# EAGLE design WalkerStalkerv03 (EAGLE 6.4)
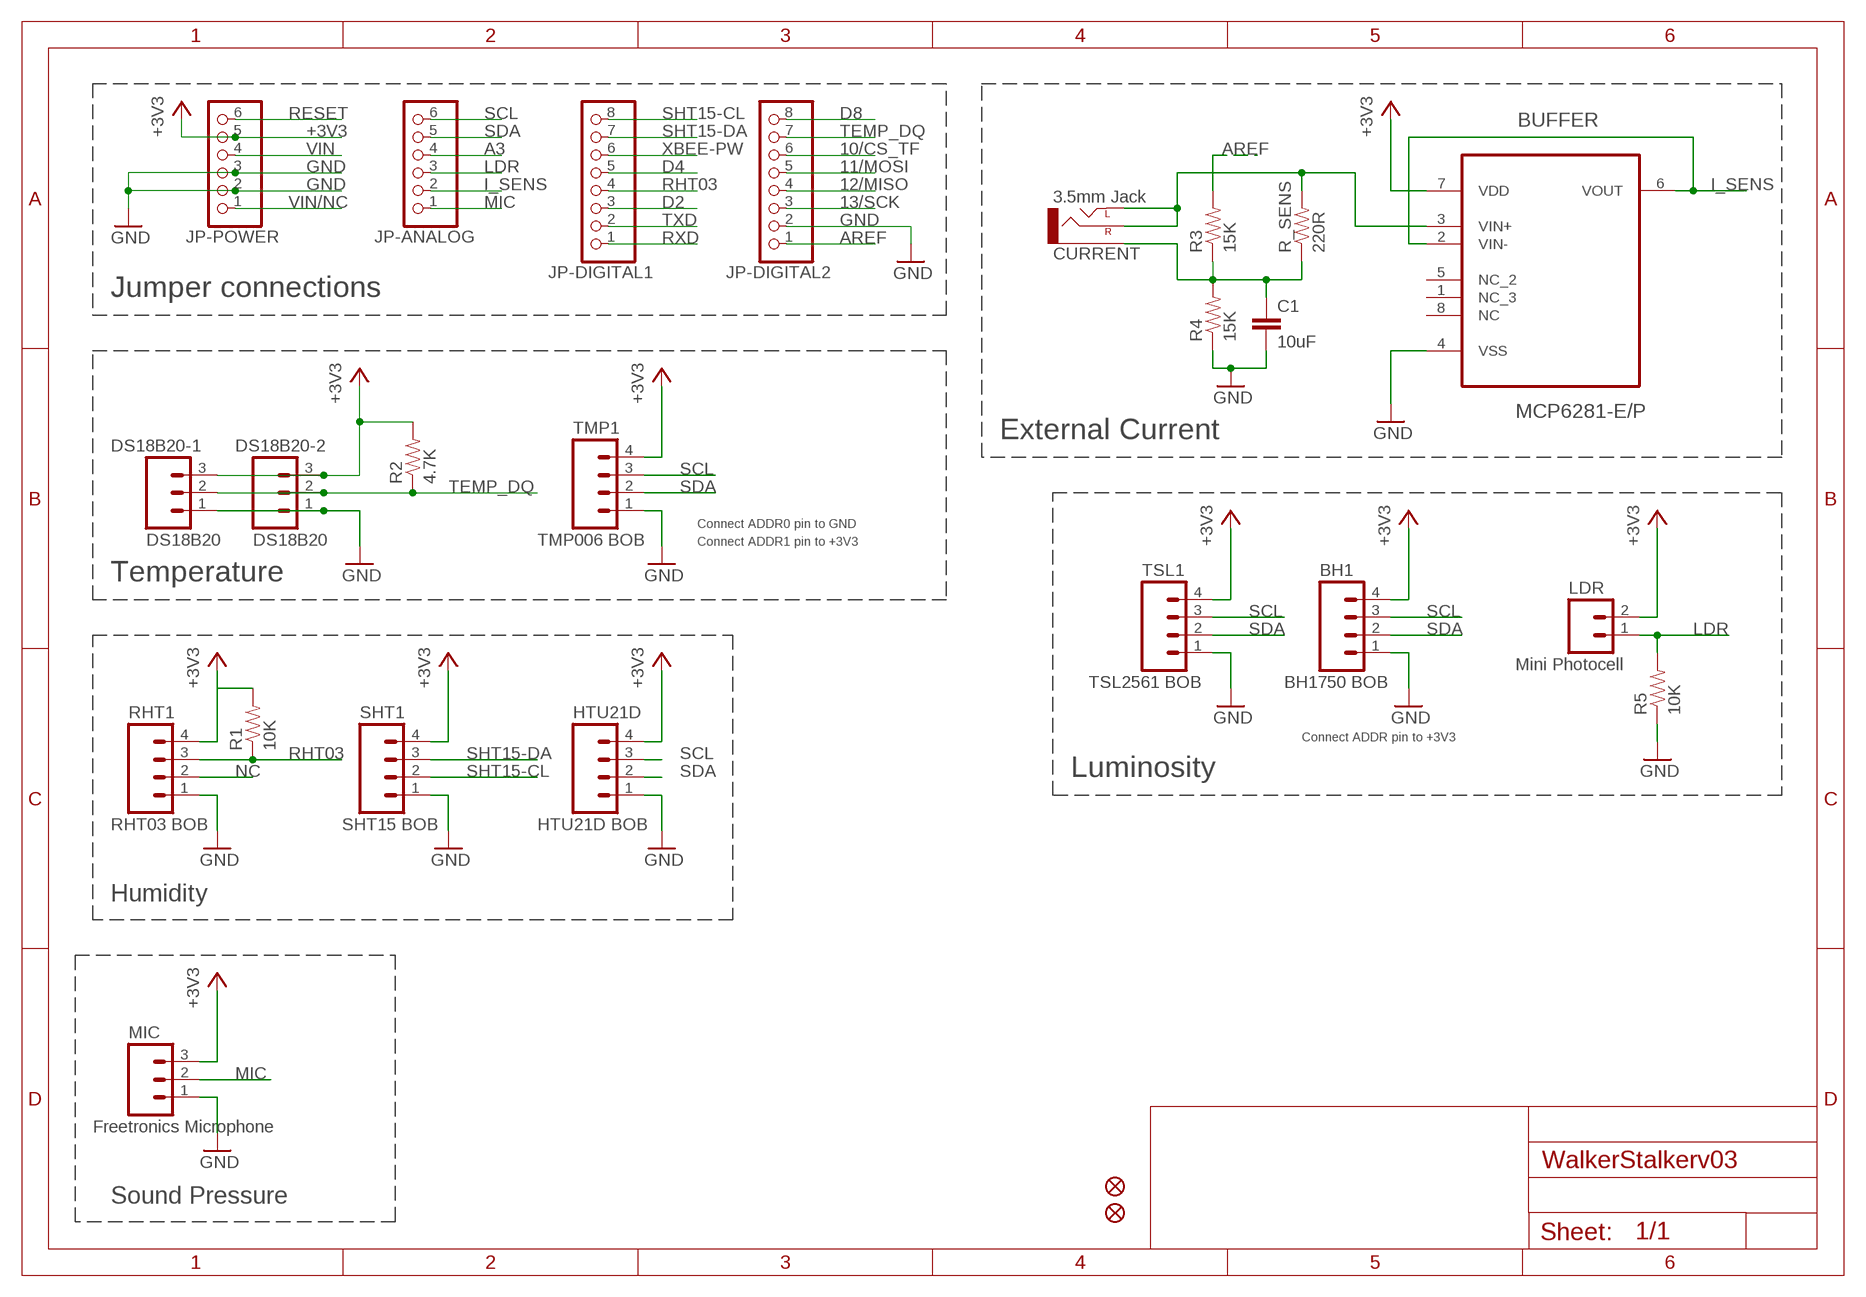
[diagram p0: schematic, sheet 1, part 1 of 2]
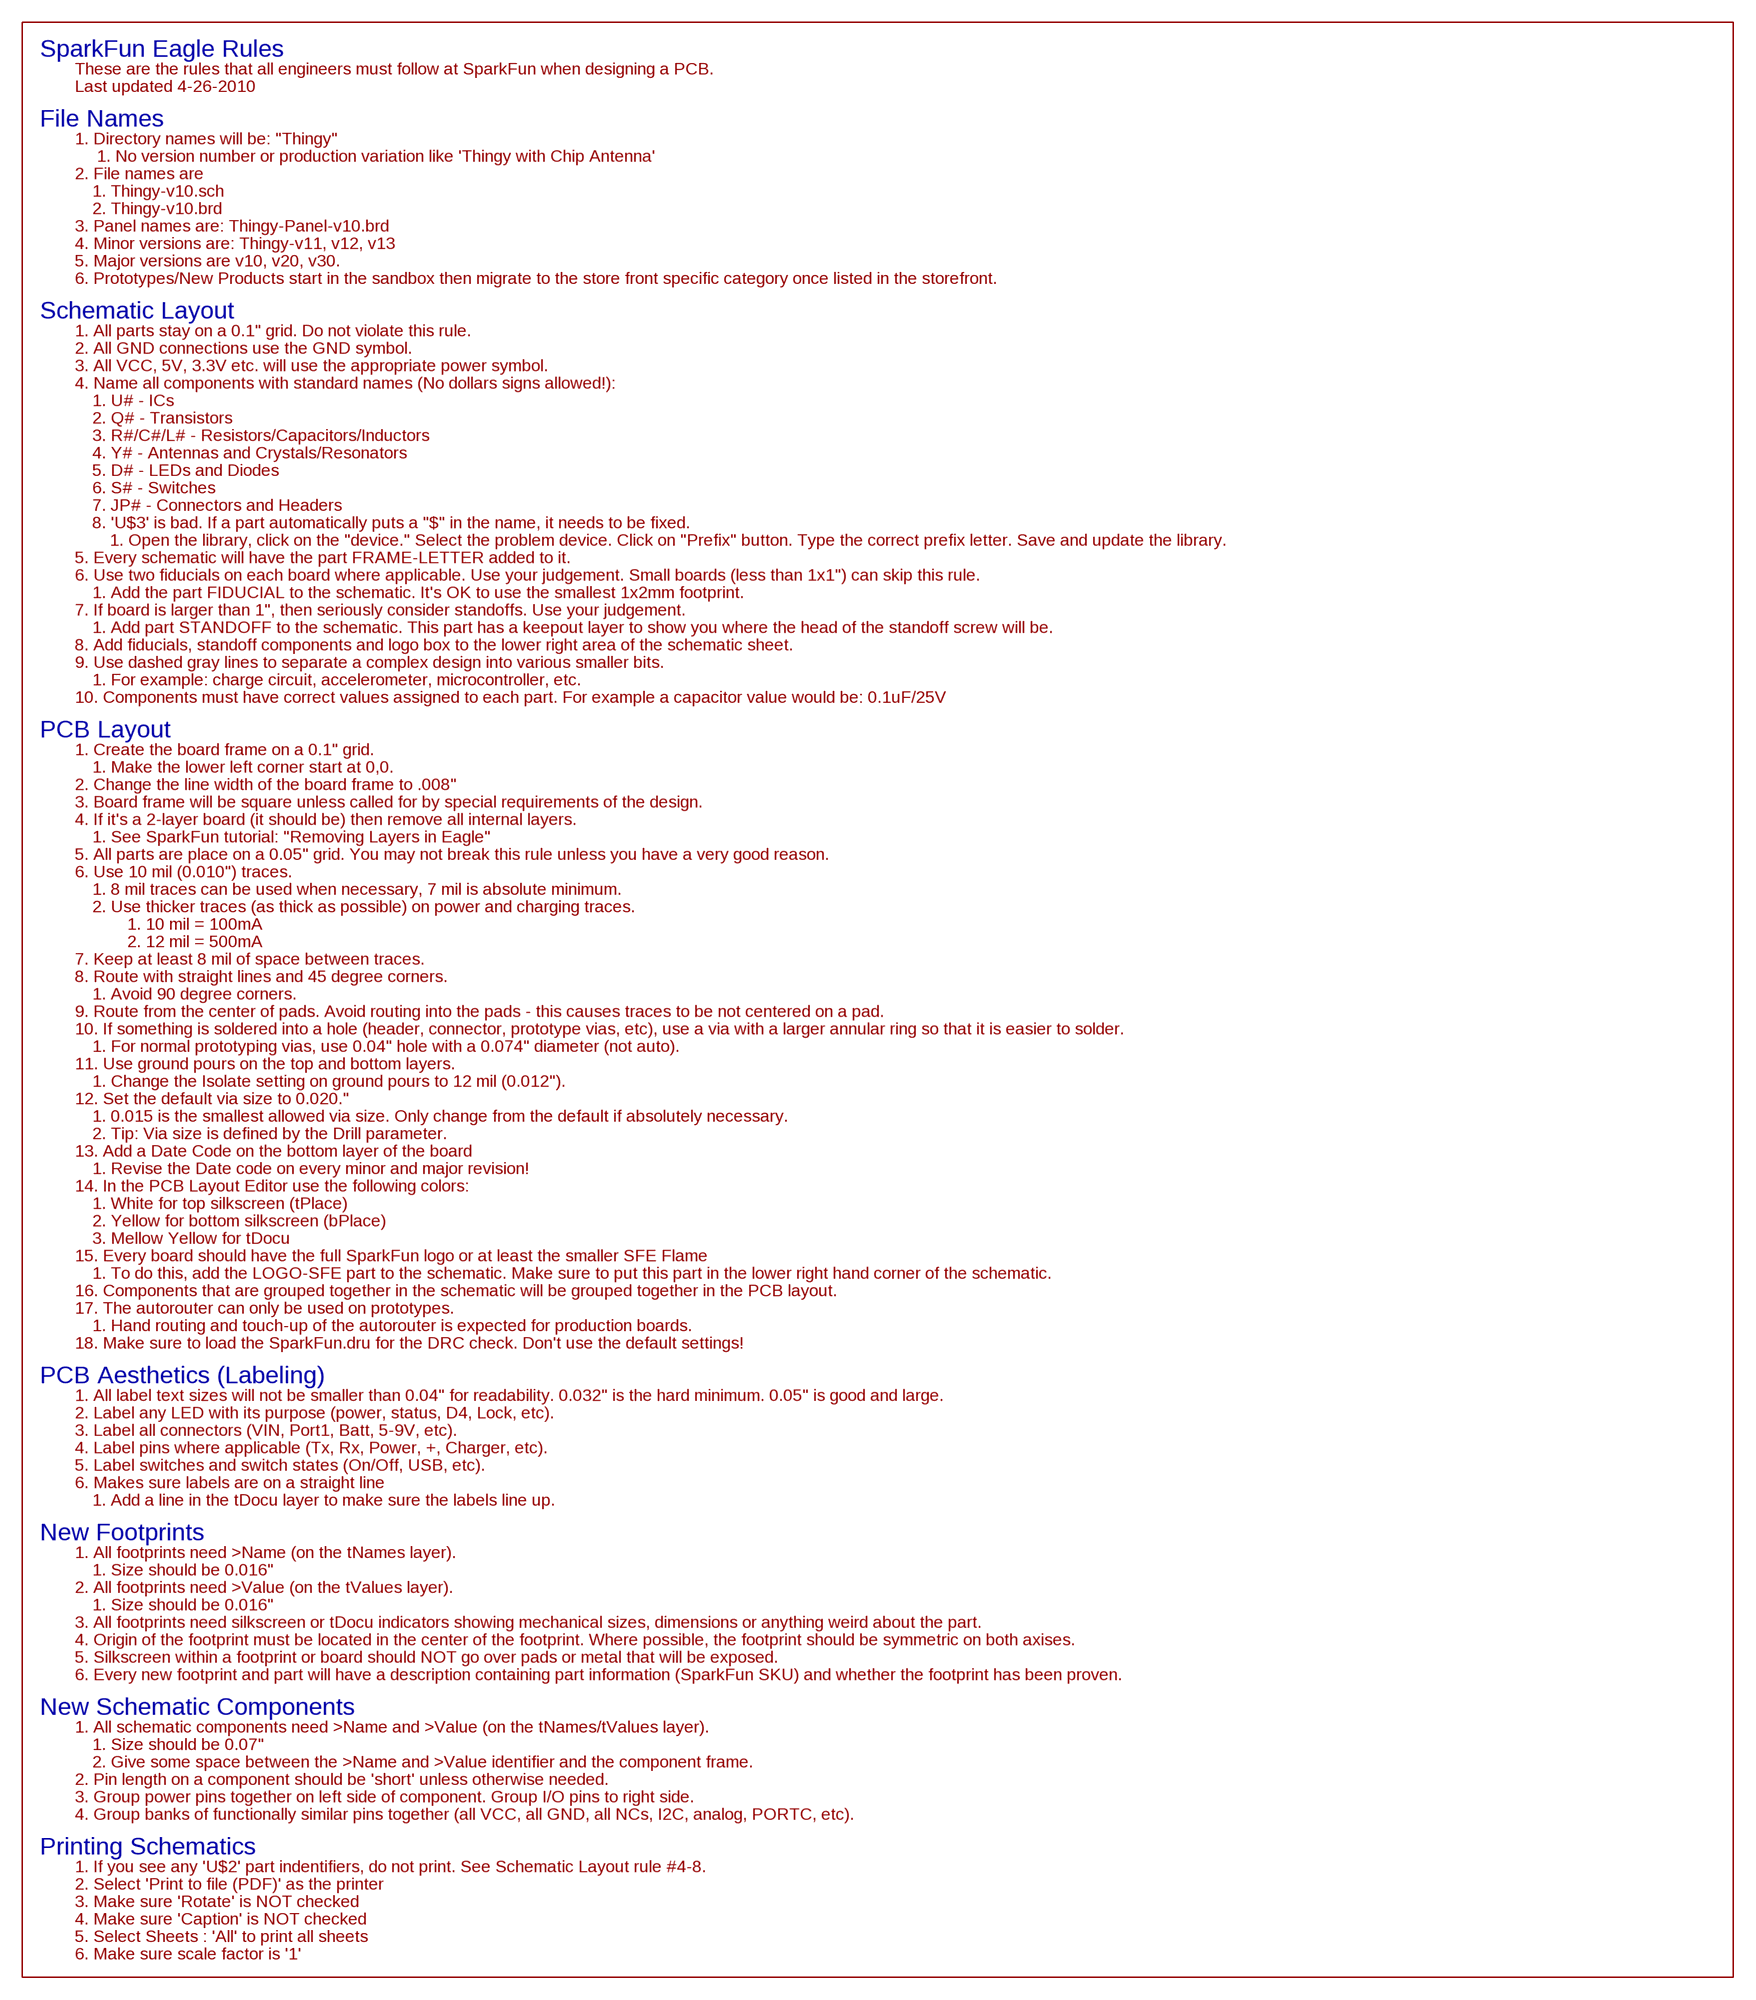
[diagram p1: schematic, sheet 1, part 2 of 2]

## Parts
BH1  BH1750 BOB  M04POLAR  [MOLEX-1X4]
BUFFER  MCP6281-E/P  [DIP254P762X432-8]
C1  10uF  CAP1206  [1206]
CURRENT  3.5mm Jack  AUDIO-JACKPTH  [AUDIO-JACK]
DS18B20-1  DS18B20  M03POLAR  [MOLEX-1X3]
DS18B20-2  DS18B20  M03POLAR  [MOLEX-1X3]
FID1  FIDUCIAL1.5X3  [FIDUCIAL-1.5X3]
FID2  FIDUCIAL1.5X3  [FIDUCIAL-1.5X3]
HTU21D  HTU21D BOB  M04POLAR  [MOLEX-1X4]
JP-ANALOG  PINHD-1X6CB  [1X06-CLEANBIG]
JP-DIGITAL1  PINHD-1X8CLEANBIG  [1X08-CLEANBIG]
JP-DIGITAL2  PINHD-1X8CLEANBIG  [1X08-CLEANBIG]
JP-POWER  PINHD-1X6CB  [1X06-CLEANBIG]
LDR  Mini Photocell  M02POLAR  [MOLEX-1X2]
MIC  Freetronics Microphone  M03POLAR  [MOLEX-1X3]
R1  10K  RESISTOR1206  [1206]
R2  4.7K  RESISTOR1206  [1206]
R3  15K  RESISTOR1206  [1206]
R4  15K  RESISTOR1206  [1206]
R5  10K  RESISTOR1206  [1206]
R_SENS  220R  RESISTOR1206  [1206]
RHT1  RHT03 BOB  M04POLAR  [MOLEX-1X4]
SHT1  SHT15 BOB  M04POLAR  [MOLEX-1X4]
TMP1  TMP006 BOB  M04POLAR  [MOLEX-1X4]
TSL1  TSL2561 BOB  M04POLAR  [MOLEX-1X4]

## Nets
10/CS_TF: JP-DIGITAL2.6
11/MOSI: JP-DIGITAL2.5
12/MISO: JP-DIGITAL2.4
13/SCK: JP-DIGITAL2.3
+3V3: BH1.4 BUFFER.7(VDD) DS18B20-1.3 DS18B20-2.3 HTU21D.4 JP-POWER.5 LDR.2 MIC.3 R1.2 R2.2 RHT1.4 SHT1.4 TMP1.4 TSL1.4
A3: JP-ANALOG.4
AREF: JP-DIGITAL2.1 R3.2
D2: JP-DIGITAL1.3
D4: JP-DIGITAL1.5
D8: JP-DIGITAL2.8
GND: BH1.1 BUFFER.4(VSS) C1.2 DS18B20-1.1 DS18B20-2.1 HTU21D.1 JP-DIGITAL2.2 JP-POWER.2 JP-POWER.3 MIC.1 R4.1 R5.1 RHT1.1 SHT1.1 TMP1.1 TSL1.1
I_SENS: BUFFER.2(VIN-) BUFFER.6(VOUT) JP-ANALOG.2
LDR: JP-ANALOG.3 LDR.1 R5.2
MIC: JP-ANALOG.1 MIC.2
N$1: BUFFER.3(VIN+) CURRENT.RING(RIGHT) CURRENT.TIP(LEFT) R_SENS.2
N$2: C1.1 CURRENT.SLEEVE R3.1 R4.2 R_SENS.1
NC: RHT1.2
RESET: JP-POWER.6
RHT03: JP-DIGITAL1.4 R1.1 RHT1.3
RXD: JP-DIGITAL1.1
SCL: BH1.3 HTU21D.3 JP-ANALOG.6 TMP1.3 TSL1.3
SDA: BH1.2 HTU21D.2 JP-ANALOG.5 TMP1.2 TSL1.2
SHT15-CL: JP-DIGITAL1.8 SHT1.2
SHT15-DA: JP-DIGITAL1.7 SHT1.3
TEMP_DQ: DS18B20-1.2 DS18B20-2.2 JP-DIGITAL2.7 R2.1
TXD: JP-DIGITAL1.2
VIN: JP-POWER.4
VIN/NC: JP-POWER.1
XBEE-PW: JP-DIGITAL1.6
Unconnected: BUFFER.1(NC_3) BUFFER.5(NC_2) BUFFER.8(NC)

## Notes on the sheet
- Jumper connections
- External Current
- Connect ADDR0 pin to GND
- Connect ADDR1 pin to +3V3
- Temperature
- Connect ADDR pin to +3V3
- Luminosity
- Humidity
- Sound Pressure

## Library data of the parts
BH1 HTU21D RHT1 SHT1 TMP1 TSL1 = SparkFun-Connectors:M04: Header 4 Standard 4-pin 0.1" header. Use with straight break away headers (SKU : PRT-00116), right angle break away headers (PRT-00553), swiss pins (PRT-00743), machine pins (PRT-00117), and female headers (PRT-00115). Molex polarized connector foot print use with SKU : PRT-08231 with associated crimp pins and housings. 1MM SMD Version SKU: PRT-10208
BUFFER = Microchip_By_element14_Batch_1:MCP6281-E/P: Rail-to-Rail Op Amp; DESCRIPTION: OP AMP; MPN: MCP6281-E/P; OC_FARNELL: 1439456; OC_NEWARK: -; PACKAGE: DIP-8; SUPPLIER: Microchip
C1 = SparkFun-Capacitors:CAP: Capacitor Standard 0603 ceramic capacitor, and 0.1" leaded capacitor.
CURRENT = SparkFun-Connectors:AUDIO-JACK: 3.5mm Audio Jack Simple 3.5mm common PCB mount audio jack. SKU: PRT-08032
DS18B20-1 DS18B20-2 MIC = SparkFun-Connectors:M03: Header 3 Standard 3-pin 0.1" header. Use with straight break away headers (SKU : PRT-00116), right angle break away headers (PRT-00553), swiss pins (PRT-00743), machine pins (PRT-00117), and female headers (PRT-00115). Molex polarized connector foot print use with SKU : PRT-08232 with associated crimp pins and housings.
FID1 FID2 = SparkFun-Aesthetics:FIDUCIAL: Fiducial Alignment Points Various fiducial points for machine vision alignment.
JP-ANALOG JP-POWER = carduino:PINHD-1X6: PIN HEADER
JP-DIGITAL1 JP-DIGITAL2 = carduino:PINHD-1X8: PIN HEADER
LDR = SparkFun-Connectors:M02: Header 2 Standard 2-pin 0.1" header. Use with straight break away headers (SKU : PRT-00116), right angle break away headers (PRT-00553), swiss pins (PRT-00743), machine pins (PRT-00117), and female headers (PRT-00115). Molex polarized connector foot print use with SKU : PRT-08233 with associated crimp pins and housings.
R1-R5 R_SENS = SparkFun-Resistors:RESISTOR: Resistor Basic schematic elements and footprints for 0603, 1206, and PTH resistors.

## Board
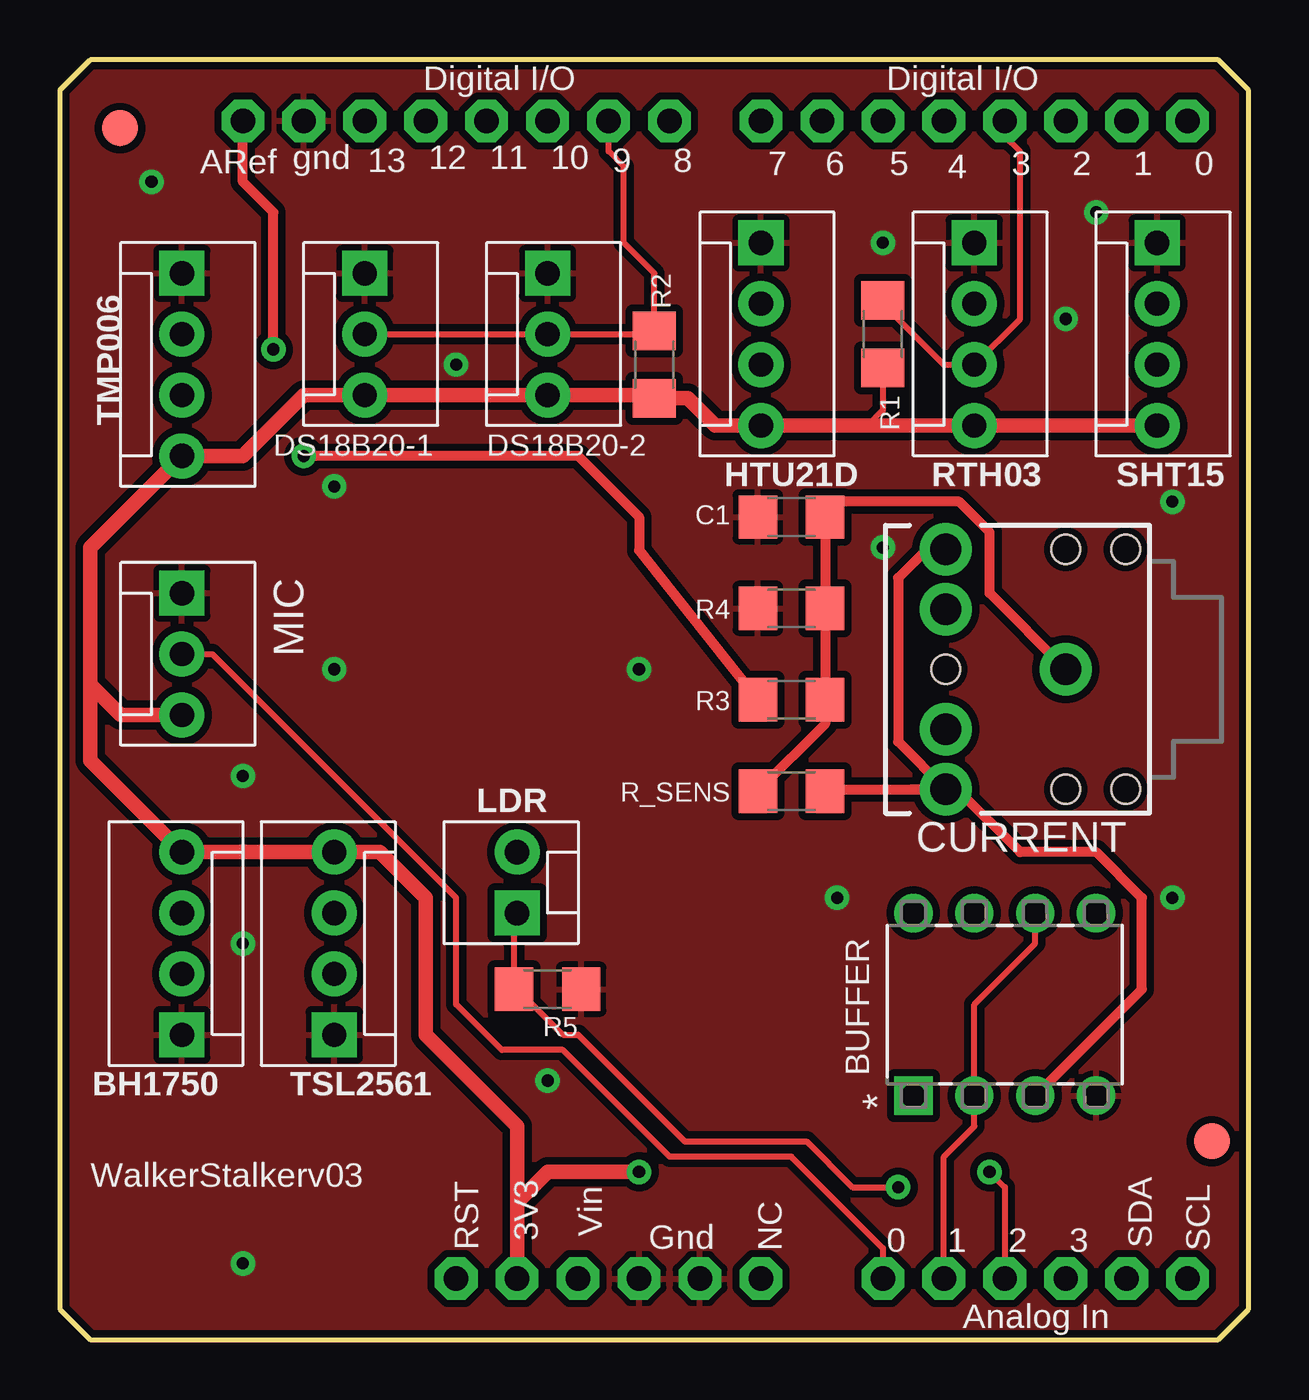
[diagram p2: board, top side]
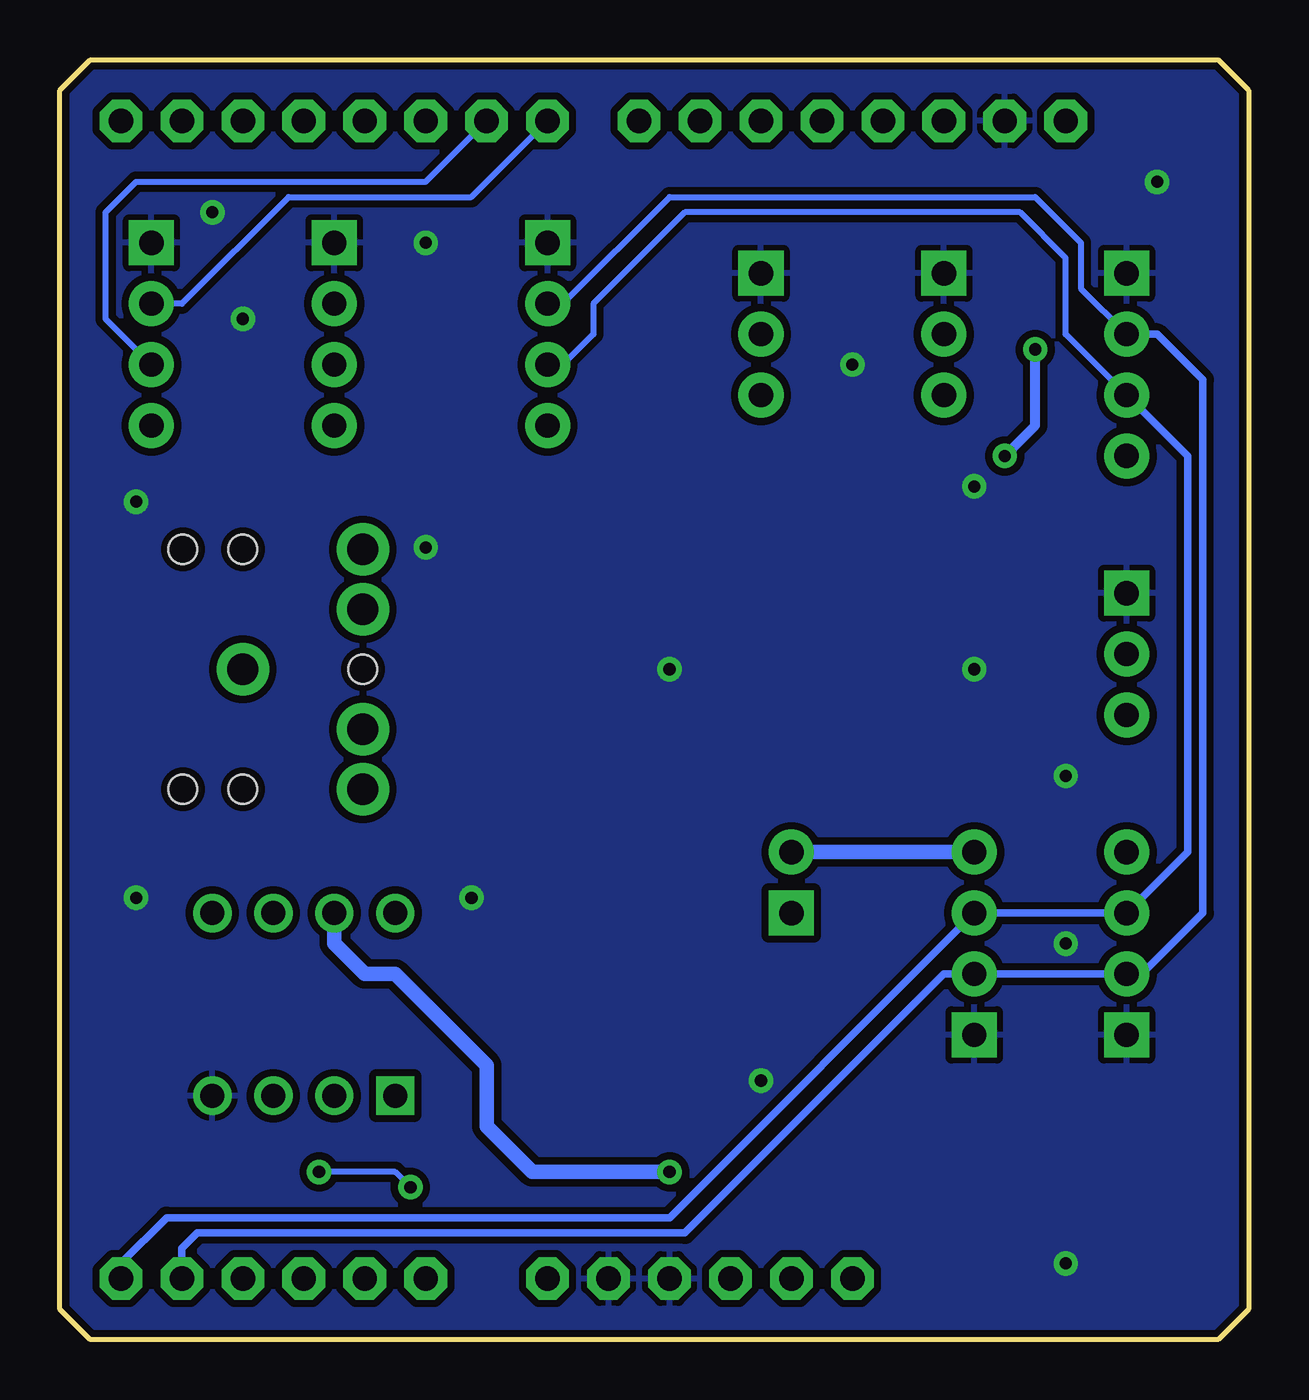
[diagram p3: board, bottom side, seen from below]

Size 49.53 x 53.34 mm. Coordinates in mm from the lower left corner, seen from the top.
Outline: 1.27,0 48.26,0 49.53,1.27 49.53,52.07 48.26,53.34 1.27,53.34 0,52.07 0,1.27 1.27,0
Copper layers (1*16): Top 0.035mm / dielectric 1.5mm / Bottom 0.035mm
Design rules "SparkFun": minimum track width 8mil, minimum drill 20mil, track to track 8mil, track to pad 8mil, pad to pad 8mil, via to via 8mil, smd to smd 8mil, copper to edge 10mil, drill to drill 8mil, minimum pad ring 12mil, minimum via ring 10mil, stop-mask expansion 4mil, vias tented up to drill 25mil, thermal gap 10mil

### Footprints (pad centres in the part's own frame; a part is rotated, then mirrored left to right if it is on the bottom)
MOLEX-1X4 = drill 1.016 pad 1.88 square: 1 0,0 | drill 1.016 pad 1.88: 2 2.54,0; 3 5.08,0; 4 7.62,0
DIP254P762X432-8 = drill 0.991 square: 1 -7.62,7.62 | drill 0.991: 2 -7.62,5.08; 3 -7.62,2.54; 4 -7.62,0; 5 0,0; 6 0,2.54; 7 0,5.08; 8 0,7.62
1206 = smd 1.6 x 1.8: 1 -1.4,0; 2 1.4,0
AUDIO-JACK = drill 1.3 pad 2.184: RING 5,5; RSH 5,2.5; SLEEVE 0,0; TIP 5,-5; TSH 5,-2.5 | hole 1.2: 0,5; -2.5,5; -2.5,-5; 0,-5; 5,0
MOLEX-1X3 = drill 1.016 pad 1.88 square: 1 0,0 | drill 1.016 pad 1.88: 2 2.54,0; 3 5.08,0
FIDUCIAL-1.5X3 = smd 1.5 x 1.5: 1 0,0
1X06-CLEANBIG = drill 1.016 pad 1.778 octagon: 1 -6.35,0; 2 -3.81,0; 3 -1.27,0; 4 1.27,0; 5 3.81,0; 6 6.35,0
1X08-CLEANBIG = drill 1.016 pad 1.778 octagon: 1 -8.89,0; 2 -6.35,0; 3 -3.81,0; 4 -1.27,0; 5 1.27,0; 6 3.81,0; 7 6.35,0; 8 8.89,0
MOLEX-1X2 = drill 1.016 pad 1.88 square: 1 0,0 | drill 1.016 pad 1.88: 2 2.54,0

### Placement (x,y rotation side)
BH1  5.08,12.7 90 top
BUFFER  43.18,17.78 90 top
C1  30.48,34.29 180 top
CURRENT  41.91,27.94 180 top
DS18B20-1  12.7,44.45 270 top
DS18B20-2  20.32,44.45 270 top
FID1  48,8.27 0 top
FID2  2.5,50.5 0 top
HTU21D  29.21,45.72 270 top
JP-ANALOG  40.64,2.54 0 top
JP-DIGITAL1  38.1,50.8 180 top
JP-DIGITAL2  16.51,50.8 0 top
JP-POWER  22.86,2.54 180 top
LDR  19.05,17.78 90 top
MIC  5.08,31.11 270 top
R1  34.29,41.91 270 top
R2  24.76,40.64 270 top
R3  30.48,26.67 180 top
R4  30.48,30.48 0 top
R5  20.32,14.61 180 top
R_SENS  30.48,22.86 0 top
RHT1  38.1,45.72 270 top
SHT1  45.72,45.72 270 top
TMP1  5.08,44.45 270 top
TSL1  11.43,12.7 90 top

### Tracks (layer width: path | path; a pad name or v marks a point on that pad's centre or on a via)
+3V3  (via drill 0.51)
  Top 0.254: R1.2 34.29,38.73 33.66,38.1
  Top 0.61: SHT1.4 RHT1.4 33.66,38.1 HTU21D.4 27.3,38.1 26.17,39.24 R2.2 24.63,39.37 DS18B20-2.3 DS18B20-1.3 10.16,39.37 7.62,36.83 TMP1.4 1.27,33.02 1.27,27.3 | 1.27,27.3 1.27,24.13 BH1.4 TSL1.4 13.34,20.32 15.24,18.41 15.24,12.7 19.05,8.89 19.05,5.71 | MIC.3 2.54,26.04 1.27,27.3 | JP-POWER.5 19.05,5.71 | v24.13,6.99 20.32,6.99 19.05,5.71
  Bottom 0.61: v24.13,6.99 29.84,6.99 31.75,8.89 31.75,11.43 35.56,15.24 36.83,15.24 38.1,16.51 BUFFER.7 | LDR.2 TSL1.4
AREF  (via drill 0.51)
  Top 0.406: v10.16,36.83 21.59,36.83 24.13,34.29 24.13,32.89 R3.2 | v8.89,41.27 8.89,46.99 7.62,48.26 JP-DIGITAL2.1
  Bottom 0.406: v10.16,36.83 8.89,38.1 v8.89,41.27
GND  (via drill 0.51)
  other vias: 7.62,23.5 11.43,27.94 11.43,35.56 24.13,27.94 46.35,34.92 46.35,18.41 32.38,18.41 7.62,3.17 7.62,16.51 3.81,48.26 43.18,46.99 41.91,42.55 34.29,45.72 16.51,40.64 20.32,10.79 34.29,33.02
  pour Top (isolate 0.305): 1.27,53.34 48.26,53.34 49.53,52.07 49.53,1.27 48.26,0 1.27,0 0,1.27 0,52.07
  pour Bottom (isolate 0.305): 0,52.07 1.27,53.34 48.26,53.34 49.53,52.07 49.53,1.27 48.26,0 1.27,0 0,1.27
I_SENS
  Top 0.254: JP-ANALOG.2 36.83,7.62 38.1,8.89 BUFFER.2 38.1,13.97 40.64,16.51 BUFFER.6
LDR  (via drill 0.51)
  Top 0.254: LDR.1 18.92,17.65 R5.2 19.05,14.61 20.95,12.7 21.59,12.7 26.04,8.26 31.11,8.26 33.02,6.35 v34.92,6.35 | v38.73,6.99 39.37,6.35 JP-ANALOG.3
  Bottom 0.254: v34.92,6.35 35.56,6.99 v38.73,6.99
MIC
  Top 0.254: MIC.2 6.35,28.57 16.51,18.41 16.51,13.97 18.41,12.06 20.95,12.06 25.4,7.62 30.48,7.62 34.29,3.81 JP-ANALOG.1
N$1
  Top 0.254: CURRENT.RING 36.83,22.86
  Top 0.406: CURRENT.RING 31.96,22.94 R_SENS.2 | BUFFER.3 45.09,14.61 45.09,18.41 43.18,20.32 40.01,20.32 37.38,22.94 CURRENT.RING | CURRENT.RING 35.48,22.94 | CURRENT.TIP 36.12,32.94 34.92,31.75 34.92,24.93 CURRENT.RING
N$2
  Top 0.406: CURRENT.SLEEVE 38.73,31.11 38.73,33.66 37.47,34.92 32.52,34.92 C1.1 R4.2 R3.1 31.88,25.66 R_SENS.1
RHT03
  Top 0.254: JP-DIGITAL1.4 39.37,50.16 40.01,49.53 40.01,42.55 RHT1.3 36.83,40.64 34.29,43.18 R1.1
SCL
  Bottom 0.254: TMP1.3 7.62,41.91 7.62,45.09 9.53,46.99 23.5,46.99 27.3,43.18 27.3,41.91 28.57,40.64 HTU21D.3
  Bottom 0.305: TMP1.3 2.54,36.83 2.54,20.32 BH1.3 TSL1.3 24.13,5.08 45.09,5.08 46.99,3.17 JP-ANALOG.6
SDA
  Bottom 0.254: TMP1.2 6.99,43.81 6.99,45.72 8.89,47.62 24.13,47.62 28.57,43.18 HTU21D.2
  Bottom 0.305: TMP1.2 3.81,41.91 1.91,40.01 1.91,17.78 4.45,15.24 BH1.2 TSL1.2 12.7,15.24 23.5,4.45 43.81,4.45 44.45,3.81 JP-ANALOG.5
SHT15-CL
  Bottom 0.254: SHT1.2 44.45,43.18 40.01,47.62 32.38,47.62 JP-DIGITAL1.8
SHT15-DA
  Bottom 0.254: SHT1.3 47.62,42.55 47.62,46.99 46.35,48.26 34.29,48.26 JP-DIGITAL1.7
TEMP_DQ
  Top 0.254: DS18B20-1.2 DS18B20-2.2 24.64,41.91 R2.1 24.77,44.45 23.5,45.72 23.5,48.9 22.86,49.53 JP-DIGITAL2.7

### Text on the board
tPlace: Digital I/O | Digital I/O | ARef | gnd | 13 | 12 | 11 | 10 | 9 | 8 | 7 | 6 | 5 | 3 | 2 | 1 | 0 | 4 | RST | 3V3 | Vin | NC | Gnd | 0 | 1 | 2 | 3 | SDA | SCL | Analog In
tNames: TMP006 | HTU21D | RTH03 | SHT15 | LDR | BH1750 | TSL2561